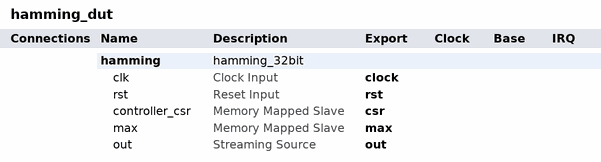
[diagram p0: system contents]
# Platform Designer (Qsys) system hamming_dut, Cyclone V 5CSXFC6C6U23C8ES
# Parameters at their usual value, and those the tool derives, are not listed.
package require qsys
create_system hamming_dut
set_project_property DEVICE_FAMILY {Cyclone V}
set_project_property DEVICE 5CSXFC6C6U23C8ES

add_instance hamming hamming_32bit 1.0

# exported interfaces
add_interface max avalon slave
set_interface_property max EXPORT_OF hamming.max
add_interface out avalon_streaming source
set_interface_property out EXPORT_OF hamming.out
add_interface rst reset sink
set_interface_property rst EXPORT_OF hamming.rst
add_interface clock clock sink
set_interface_property clock EXPORT_OF hamming.clk
add_interface csr avalon slave
set_interface_property csr EXPORT_OF hamming.controller_csr

set_interconnect_requirement {$system} qsys_mm.clockCrossingAdapter HANDSHAKE
set_interconnect_requirement {$system} qsys_mm.maxAdditionalLatency 1
set_interconnect_requirement {$system} qsys_mm.insertDefaultSlave false

save_system hamming_dut.qsys
